# Altium schematic sheet RX_FlexiConnectors.SchDoc: Laser PCB
size A3; DrawnBy: James Singleton; Organization: TMC Technology Ltd.; DocumentNumber: 10; Revision: A; SheetNumber: 9; SheetTotal: 18; Drawn Date: 22/12/2020
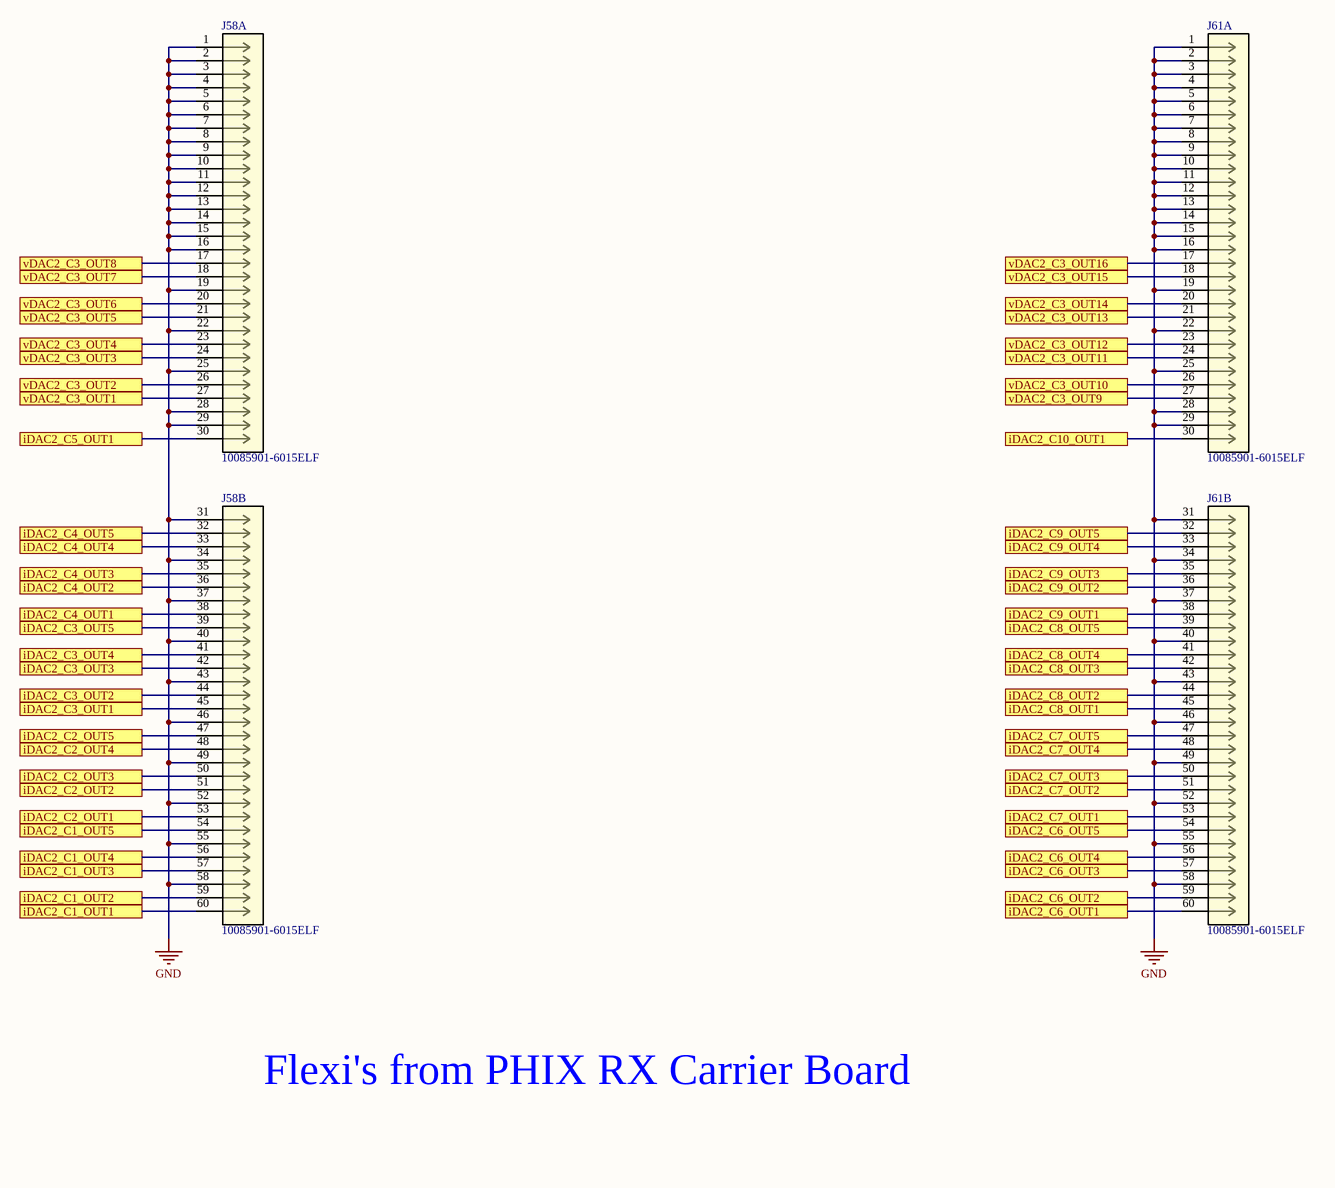
[diagram p0: RX_FlexiConnectors.SchDoc]

## Parts
J58  10085901-6015ELF  [CONN_10085901-6015ELF_AMP]  (parts A,B of 2)
J61  10085901-6015ELF  [CONN_10085901-6015ELF_AMP]  (parts A,B of 2)

## Ports
iDAC2_C1_OUT1 (see iDAC2[4A]), iDAC2_C1_OUT2 (see iDAC2[4B]), iDAC2_C1_OUT3 (see iDAC2[4B]), iDAC2_C1_OUT4 (see iDAC2[4B]), iDAC2_C1_OUT5 (see iDAC2[4B]), iDAC2_C2_OUT1 (see iDAC2[4B]), iDAC2_C2_OUT2 (see iDAC2[4B]), iDAC2_C2_OUT3 (see iDAC2[4B]), iDAC2_C2_OUT4 (see iDAC2[4B]), iDAC2_C2_OUT5 (see iDAC2[4B]), iDAC2_C3_OUT1 (see iDAC2[4B]), iDAC2_C3_OUT2 (see iDAC2[4B]), iDAC2_C3_OUT3 (see iDAC2[4B]), iDAC2_C3_OUT4 (see iDAC2[4B]), iDAC2_C3_OUT5 (see iDAC2[4B]), iDAC2_C4_OUT1 (see iDAC2[4C]), iDAC2_C4_OUT2 (see iDAC2[4C]), iDAC2_C4_OUT3 (see iDAC2[4C]), iDAC2_C4_OUT4 (see iDAC2[4C]), iDAC2_C4_OUT5 (see iDAC2[4C]), iDAC2_C5_OUT1 (see iDAC2[4C]), iDAC2_C6_OUT1 (see iDAC2[6A]), iDAC2_C6_OUT2 (see iDAC2[6B]), iDAC2_C6_OUT3 (see iDAC2[6B]), iDAC2_C6_OUT4 (see iDAC2[6B]), iDAC2_C6_OUT5 (see iDAC2[6B]), iDAC2_C7_OUT1 (see iDAC2[6B]), iDAC2_C7_OUT2 (see iDAC2[6B]), iDAC2_C7_OUT3 (see iDAC2[6B]), iDAC2_C7_OUT4 (see iDAC2[6B]), iDAC2_C7_OUT5 (see iDAC2[6B]), iDAC2_C8_OUT1 (see iDAC2[6B]), iDAC2_C8_OUT2 (see iDAC2[6B]), iDAC2_C8_OUT3 (see iDAC2[6B]), iDAC2_C8_OUT4 (see iDAC2[6B]), iDAC2_C8_OUT5 (see iDAC2[6B]), iDAC2_C9_OUT1 (see iDAC2[6C]), iDAC2_C9_OUT2 (see iDAC2[6C]), iDAC2_C9_OUT3 (see iDAC2[6C]), iDAC2_C9_OUT4 (see iDAC2[6C]), iDAC2_C9_OUT5 (see iDAC2[6C]), iDAC2_C10_OUT1 (see iDAC2[6C]), vDAC2_C3_OUT1 (see vDAC2[3C]), vDAC2_C3_OUT2 (see vDAC2[3C]), vDAC2_C3_OUT3 (see vDAC2[3C]), vDAC2_C3_OUT4 (see vDAC2[3C]), vDAC2_C3_OUT5 (see vDAC2[3C]), vDAC2_C3_OUT6 (see vDAC2[5C]), vDAC2_C3_OUT7 (see vDAC2[5C]), vDAC2_C3_OUT8 (see vDAC2[5C]), vDAC2_C3_OUT9 (see vDAC2[5C]), vDAC2_C3_OUT10 (see vDAC2[5C]), vDAC2_C3_OUT11 (see vDAC2[5C]), vDAC2_C3_OUT12 (see vDAC2[5C]), vDAC2_C3_OUT13 (see vDAC2[5C]), vDAC2_C3_OUT14 (see vDAC2[5C]), vDAC2_C3_OUT15 (see vDAC2[5C]), vDAC2_C3_OUT16 (see vDAC2[5C])

## Nets
GND: J58.1 J58.2 J58.3 J58.4 J58.5 J58.6 J58.7 J58.8 J58.9 J58.10 J58.11 J58.12 J58.13 J58.14 J58.15 J58.16 J58.19 J58.22 J58.25 J58.28 J58.29 J58.31 J58.34 J58.37 J58.40 J58.43 J58.46 J58.49 J58.52 J58.55 J58.58 J61.1 J61.2 J61.3 J61.4 J61.5 J61.6 J61.7 J61.8 J61.9 J61.10 J61.11 J61.12 J61.13 J61.14 J61.15 J61.16 J61.19 J61.22 J61.25 J61.28 J61.29 J61.31 J61.34 J61.37 J61.40 J61.43 J61.46 J61.49 J61.52 J61.55 J61.58
iDAC2_C1_OUT1: J58.60 ; port iDAC2_C1_OUT1
iDAC2_C1_OUT2: J58.59 ; port iDAC2_C1_OUT2
iDAC2_C1_OUT3: J58.57 ; port iDAC2_C1_OUT3
iDAC2_C1_OUT4: J58.56 ; port iDAC2_C1_OUT4
iDAC2_C1_OUT5: J58.54 ; port iDAC2_C1_OUT5
iDAC2_C2_OUT1: J58.53 ; port iDAC2_C2_OUT1
iDAC2_C2_OUT2: J58.51 ; port iDAC2_C2_OUT2
iDAC2_C2_OUT3: J58.50 ; port iDAC2_C2_OUT3
iDAC2_C2_OUT4: J58.48 ; port iDAC2_C2_OUT4
iDAC2_C2_OUT5: J58.47 ; port iDAC2_C2_OUT5
iDAC2_C3_OUT1: J58.45 ; port iDAC2_C3_OUT1
iDAC2_C3_OUT2: J58.44 ; port iDAC2_C3_OUT2
iDAC2_C3_OUT3: J58.42 ; port iDAC2_C3_OUT3
iDAC2_C3_OUT4: J58.41 ; port iDAC2_C3_OUT4
iDAC2_C3_OUT5: J58.39 ; port iDAC2_C3_OUT5
iDAC2_C4_OUT1: J58.38 ; port iDAC2_C4_OUT1
iDAC2_C4_OUT2: J58.36 ; port iDAC2_C4_OUT2
iDAC2_C4_OUT3: J58.35 ; port iDAC2_C4_OUT3
iDAC2_C4_OUT4: J58.33 ; port iDAC2_C4_OUT4
iDAC2_C4_OUT5: J58.32 ; port iDAC2_C4_OUT5
iDAC2_C5_OUT1: J58.30 ; port iDAC2_C5_OUT1
iDAC2_C6_OUT1: J61.60 ; port iDAC2_C6_OUT1
iDAC2_C6_OUT2: J61.59 ; port iDAC2_C6_OUT2
iDAC2_C6_OUT3: J61.57 ; port iDAC2_C6_OUT3
iDAC2_C6_OUT4: J61.56 ; port iDAC2_C6_OUT4
iDAC2_C6_OUT5: J61.54 ; port iDAC2_C6_OUT5
iDAC2_C7_OUT1: J61.53 ; port iDAC2_C7_OUT1
iDAC2_C7_OUT2: J61.51 ; port iDAC2_C7_OUT2
iDAC2_C7_OUT3: J61.50 ; port iDAC2_C7_OUT3
iDAC2_C7_OUT4: J61.48 ; port iDAC2_C7_OUT4
iDAC2_C7_OUT5: J61.47 ; port iDAC2_C7_OUT5
iDAC2_C8_OUT1: J61.45 ; port iDAC2_C8_OUT1
iDAC2_C8_OUT2: J61.44 ; port iDAC2_C8_OUT2
iDAC2_C8_OUT3: J61.42 ; port iDAC2_C8_OUT3
iDAC2_C8_OUT4: J61.41 ; port iDAC2_C8_OUT4
iDAC2_C8_OUT5: J61.39 ; port iDAC2_C8_OUT5
iDAC2_C9_OUT1: J61.38 ; port iDAC2_C9_OUT1
iDAC2_C9_OUT2: J61.36 ; port iDAC2_C9_OUT2
iDAC2_C9_OUT3: J61.35 ; port iDAC2_C9_OUT3
iDAC2_C9_OUT4: J61.33 ; port iDAC2_C9_OUT4
iDAC2_C9_OUT5: J61.32 ; port iDAC2_C9_OUT5
iDAC2_C10_OUT1: J61.30 ; port iDAC2_C10_OUT1
vDAC2_C3_OUT1: J58.27 ; port vDAC2_C3_OUT1
vDAC2_C3_OUT2: J58.26 ; port vDAC2_C3_OUT2
vDAC2_C3_OUT3: J58.24 ; port vDAC2_C3_OUT3
vDAC2_C3_OUT4: J58.23 ; port vDAC2_C3_OUT4
vDAC2_C3_OUT5: J58.21 ; port vDAC2_C3_OUT5
vDAC2_C3_OUT6: J58.20 ; port vDAC2_C3_OUT6
vDAC2_C3_OUT7: J58.18 ; port vDAC2_C3_OUT7
vDAC2_C3_OUT8: J58.17 ; port vDAC2_C3_OUT8
vDAC2_C3_OUT9: J61.27 ; port vDAC2_C3_OUT9
vDAC2_C3_OUT10: J61.26 ; port vDAC2_C3_OUT10
vDAC2_C3_OUT11: J61.24 ; port vDAC2_C3_OUT11
vDAC2_C3_OUT12: J61.23 ; port vDAC2_C3_OUT12
vDAC2_C3_OUT13: J61.21 ; port vDAC2_C3_OUT13
vDAC2_C3_OUT14: J61.20 ; port vDAC2_C3_OUT14
vDAC2_C3_OUT15: J61.18 ; port vDAC2_C3_OUT15
vDAC2_C3_OUT16: J61.17 ; port vDAC2_C3_OUT16

## Notes on the sheet
- Flexi's from PHIX RX Carrier Board
- TMC Technology Ltd.
- Page Contents:
- Project:
- Variant:
- Checked By:
- Size:
- Date:
- Dwg No:
- Sheet
- of
- Revision:

## Library data of the parts
J58 J61 = 10085901-6015ELF: No Description Available; Vendor: Amphenol; Built_By: EMA_Cory; SourceLibrary: Add_to_database_2021-04-09; System: Connector; Datasheet: https://cdn.amphenol-icc.com/media/wysiwyg/files/drawing/10085901.pdf?__cf_chl_jschl_tk__=00cf1f2338c5aeb40a4a47e00234174ceeaf26be-1617915708-0-AUipvdsWCe-XZcdQlp4wT1nonxNIPUZLiwIArEoPaP6cuSg2Amwfh3IakaG5lV7f92VjraYq1c-sb0kWBpxlvqJ5btwK7xgzNsdYdPmM7_nb70OsPjyWttq9HPXjGplazXSr1hDHv_rDyC0zqv3HN48lPyOnNuBENjkL6MLTjp3uNt_7zdD9wXF42vBbOCWCMT21rEgRTcG02oyZPRtIZwSo4Bm14CHkq-wdTg3hTL-ge00hJNPLNIP2JOl_bFxROehCM3O6jFy1LURflg9URMEHmwnyPbKOGS5_efv-ux4kMXut2MrrVkPCOaNyQI6A4DXSEQB6NjyE-YiRBZyhp3AdQLNym8hlKD61FdGHWwHwPR-a6VgqUZ92M4HgAmiZit1aB5L5iBGO44LNzjKKX60f2YBLURA21HBfVl5evVMz2Eb-ABe8B7xej-rMAyqLj9p7F-6ASMxfQEpk_K_En3gheYDfZcXem0ttM-lU-86L; Manufacturer_Part_Number: 10085901-6015ELF; Copyright: Copyright (C) 2018 Accelerated Designs. All rights reserved; RefDes: RefDes; Type: DEV